# EAGLE design yaca-base (EAGLE 5.04)
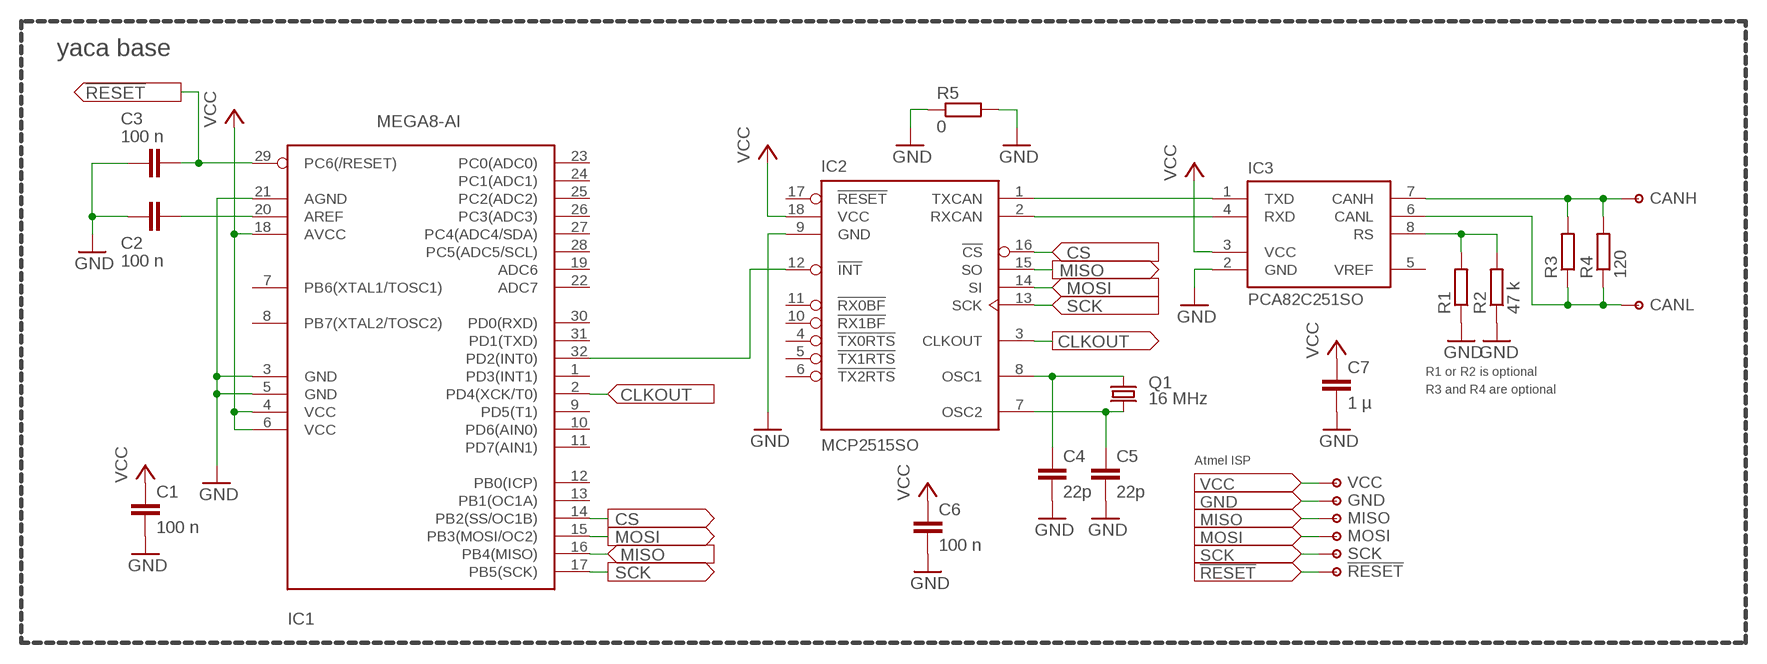
[diagram p0: schematic, sheet 1]

## Parts
C1  100 n  C-EUC0805  [C0805]
C2  100 n  C-EUC0805  [C0805]
C3  100 n  C-EUC1206  [C1206]
C4  22p  C-EUC1206  [C1206]
C5  22p  C-EUC1206  [C1206]
C6  100 n  C-EUC1206  [C1206]
C7  1 µ  C-EUC1206  [C1206]
IC1  MEGA8-AI  [TQFP32-08]
IC2  MCP2515SO  [SO18]
IC3  PCA82C251SO  [SO08]
P1  VCC  PAD  [PAD]
P2  GND  PAD  [PAD]
P3  MISO  PAD  [PAD]
P4  MOSI  PAD  [PAD]
P5  SCK  PAD  [PAD]
P6  !RESET  PAD  [PAD]
P7  CANH  PAD  [PAD]
P8  CANL  PAD  [PAD]
Q1  16 MHz  CRYSTALSM49  [SM49]
R1  47 k  R-EU_R0805  [R0805]
R2  47 k  R-EU_0204/7  [0204/7]
R3  120  R-EU_R0805  [R0805]
R4  120  R-EU_0207/10  [0207/10]
R5  0  R-EU_R1206  [R1206]

## Nets
!RESET: C3.1 IC1.29(PC6(/RESET)) P6.1(P)
CANH: IC3.7(CANH) P7.1(P) R3.2 R4.2
CANL: IC3.6(CANL) P8.1(P) R3.1 R4.1
CLKOUT: IC1.2(PD4(XCK/T0)) IC2.3(CLKOUT)
CS: IC1.14(PB2(SS/OC1B)) IC2.16(!CS)
GND: C1.2 C2.2 C3.2 C4.2 C5.2 C6.2 C7.2 IC1.3(GND) IC1.5(GND) IC1.21(AGND) IC2.9(GND) IC3.2(GND) P2.1(P) R1.1 R2.1 R5.1 R5.2
INT: IC1.32(PD2(INT0)) IC2.12(!INT)
MISO: IC1.16(PB4(MISO)) IC2.15(SO) P3.1(P)
MOSI: IC1.15(PB3(MOSI/OC2)) IC2.14(SI) P4.1(P)
N$2: C2.1 IC1.20(AREF)
RS: IC3.8(RS) R1.2 R2.2
RXCAN: IC2.2(RXCAN) IC3.4(RXD)
SCK: IC1.17(PB5(SCK)) IC2.13(SCK) P5.1(P)
TXCAN: IC2.1(TXCAN) IC3.1(TXD)
VCC: C1.1 C6.1 C7.1 IC1.4(VCC) IC1.6(VCC) IC1.18(AVCC) IC2.18(VCC) IC3.3(VCC) P1.1(P)
X1: C4.1 IC2.8(OSC1) Q1.1
X2: C5.1 IC2.7(OSC2) Q1.2
Unconnected: IC1.1(PD3(INT1)) IC1.7(PB6(XTAL1/TOSC1)) IC1.8(PB7(XTAL2/TOSC2)) IC1.9(PD5(T1)) IC1.10(PD6(AIN0)) IC1.11(PD7(AIN1)) IC1.12(PB0(ICP)) IC1.13(PB1(OC1A)) IC1.19(ADC6) IC1.22(ADC7) IC1.23(PC0(ADC0)) IC1.24(PC1(ADC1)) IC1.25(PC2(ADC2)) IC1.26(PC3(ADC3)) IC1.27(PC4(ADC4/SDA)) IC1.28(PC5(ADC5/SCL)) IC1.30(PD0(RXD)) IC1.31(PD1(TXD)) IC2.4(!TX0RTS) IC2.5(!TX1RTS) IC2.6(!TX2RTS) IC2.10(!RX1BF) IC2.11(!RX0BF) IC2.17(!RESET) IC3.5(VREF)

## Notes on the sheet
- yaca base
- R1 or R2 is optional
- R3 and R4 are optional
- Atmel ISP

## Library data of the parts
C1-C7 = rcl:C-EU: CAPACITOR, European symbol
IC1 = atmel:MEGA8: MICROCONTROLLER 8 Kbytes FLASH, 1 kbytes SRAM, 512 bytes EEPROM, USART, 6-channel 10 bit ADC, 2-channel 8 bit ADC Pin compatible with Atmega48, ATMega88, ATMega168 Source: avr.lbr
IC2 = yaca:MCP2515: MCP2515 CAN controller from Microchip
IC3 = yaca:PCA82C251: PCA82C251 or MCP2551 CAN transceivers
P1-P8 = yaca:PAD: SMD soldering pad
Q1 = crystal:CRYSTAL: CRYSTAL
R1-R5 = rcl:R-EU_: RESISTOR, European symbol

## Board
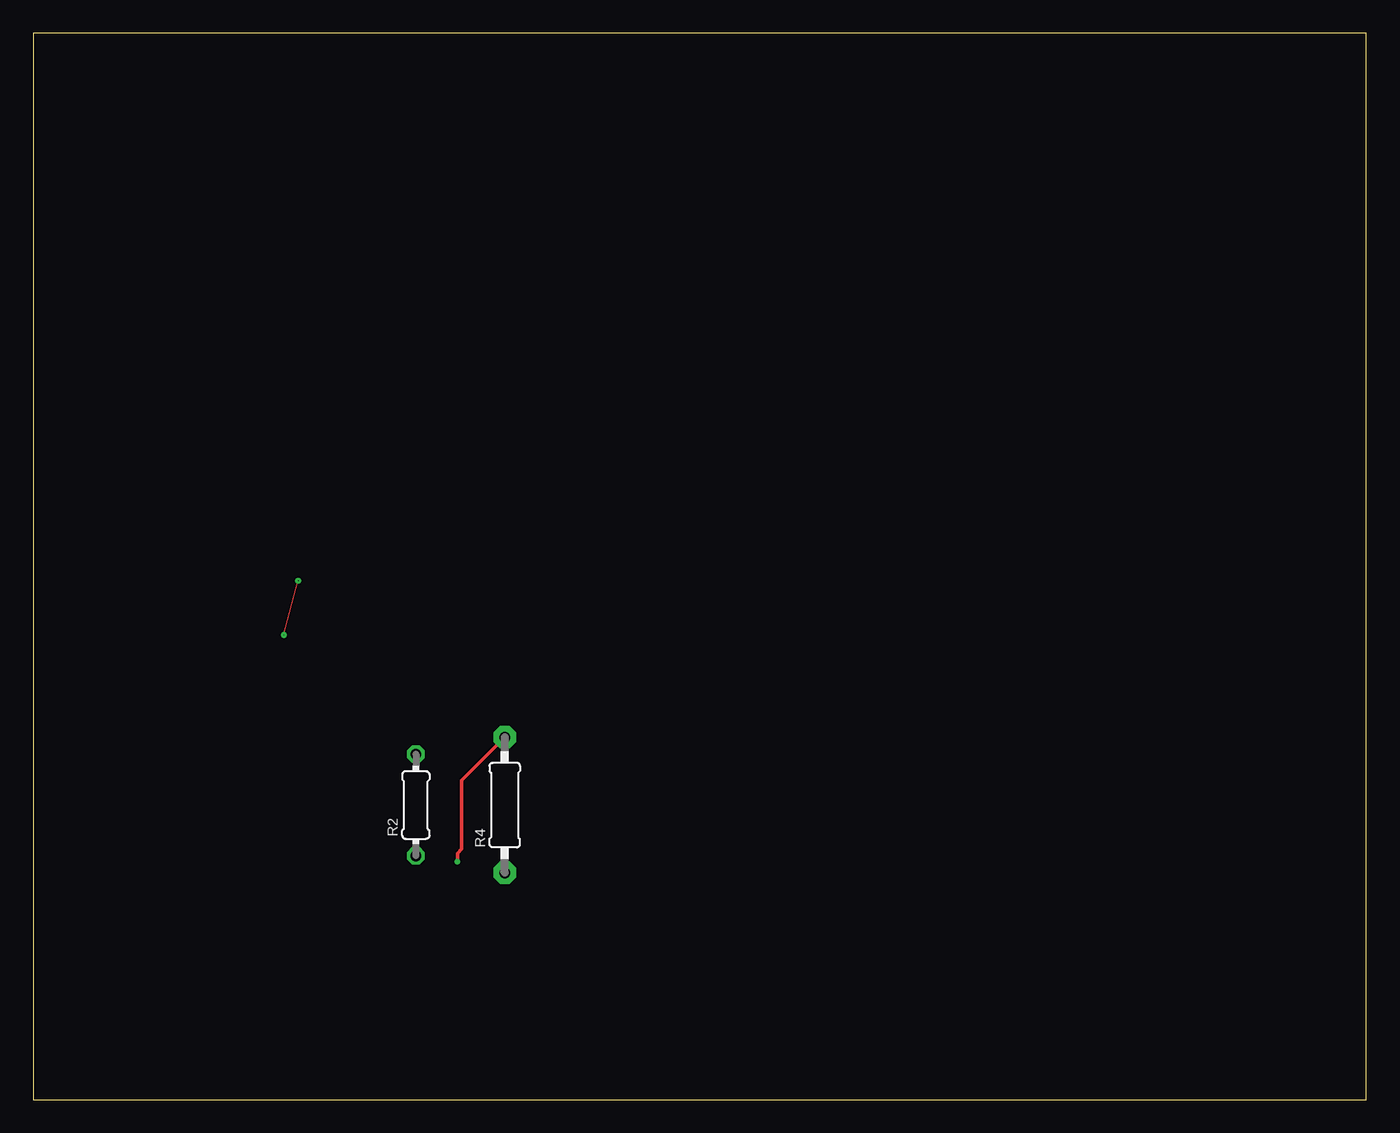
[diagram p1: board, top side]
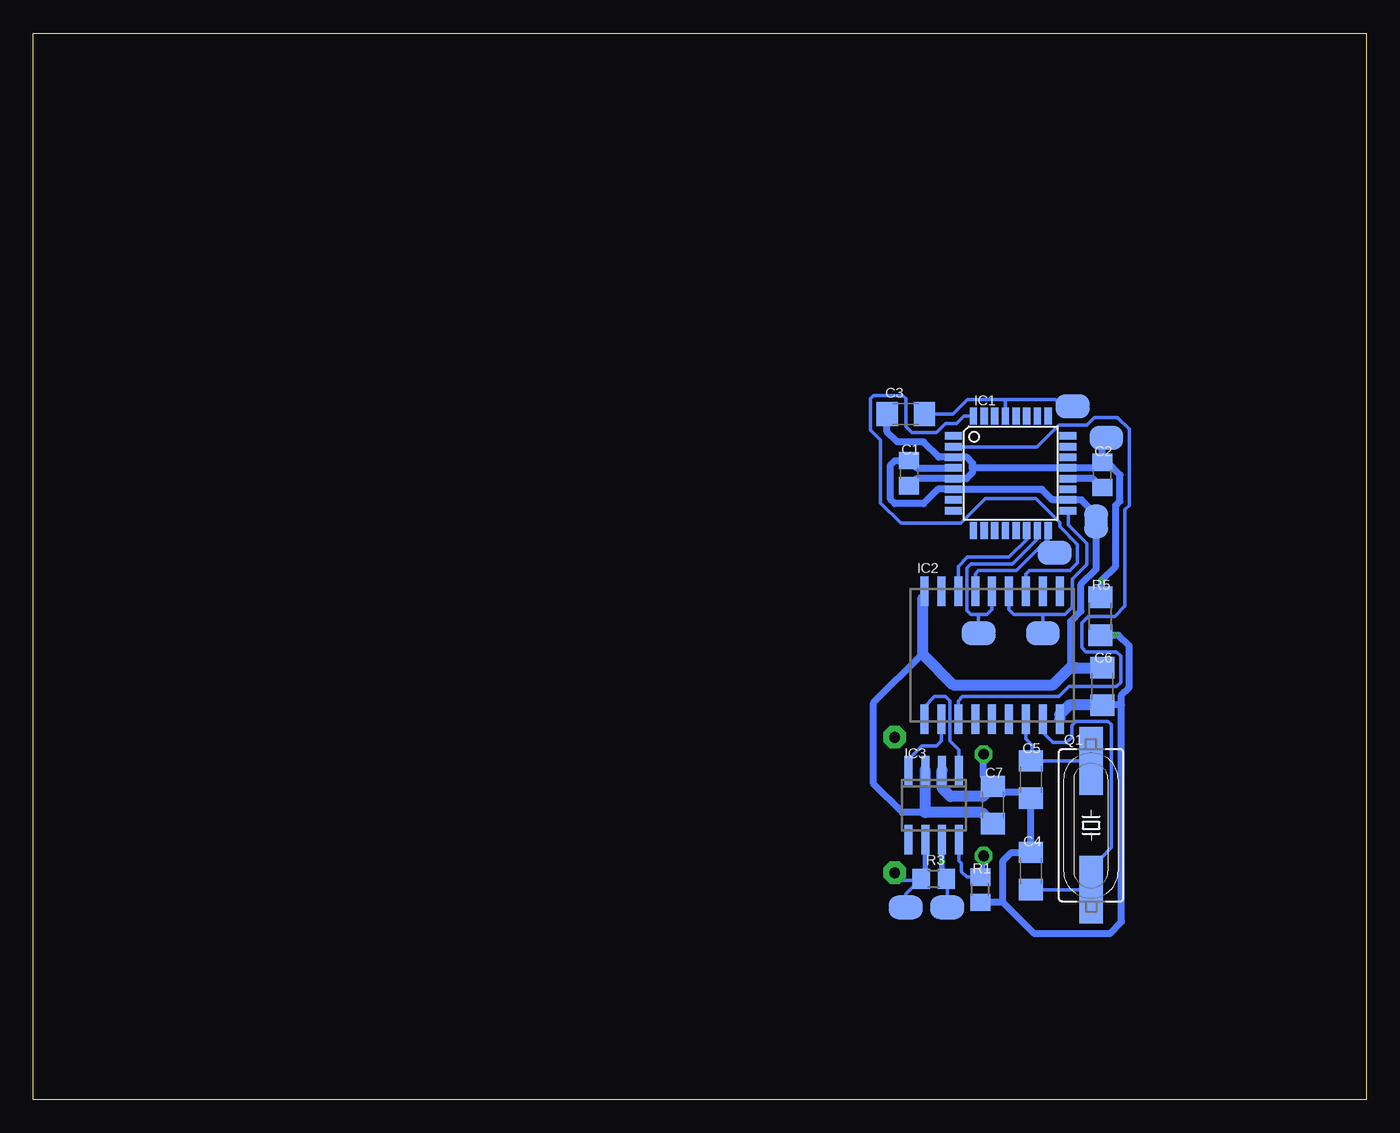
[diagram p2: board, bottom side, seen from below]

Size 100 x 80 mm. Coordinates in mm from the lower left corner, seen from the top.
Outline: 0,0 100,0 100,80 0,80 0,0
Copper layers (1*16): Top 0.035mm / dielectric 1.5mm / Bottom 0.035mm
Design rules "default": minimum track width 10mil, minimum drill 24mil, track to track 8mil, track to pad 8mil, pad to pad 8mil, via to via 8mil, smd to smd 8mil, copper to edge 40mil, drill to drill 8mil, minimum pad ring 10mil, minimum via ring 8mil, stop-mask expansion 4mil, vias tented up to drill 0mil, thermal gap 10mil

### Footprints (pad centres in the part's own frame; a part is rotated, then mirrored left to right if it is on the bottom)
C0805 = smd 1.3 x 1.5: 1 -0.95,0; 2 0.95,0
C1206 = smd 1.6 x 1.8: 1 -1.4,0; 2 1.4,0
TQFP32-08 = smd 1.27 x 0.559: 1 -4.293,2.8; 2 -4.293,2; 3 -4.293,1.2; 4 -4.293,0.4; 5 -4.293,-0.4; 6 -4.293,-1.2; 7 -4.293,-2; 8 -4.293,-2.8; 17 4.293,-2.8; 18 4.293,-2; 19 4.293,-1.2; 20 4.293,-0.4; 21 4.293,0.4; 22 4.293,1.2; 23 4.293,2; 24 4.293,2.8 | smd 0.559 x 1.27: 9 -2.8,-4.293; 10 -2,-4.293; 11 -1.2,-4.293; 12 -0.4,-4.293; 13 0.4,-4.293; 14 1.2,-4.293; 15 2,-4.293; 16 2.8,-4.293; 25 2.8,4.293; 26 2,4.293; 27 1.2,4.293; 28 0.4,4.293; 29 -0.4,4.293; 30 -1.2,4.293; 31 -2,4.293; 32 -2.8,4.293
SO18 = smd 0.6 x 2.2: 1 -5.08,-4.8; 2 -3.81,-4.8; 3 -2.54,-4.8; 4 -1.27,-4.8; 5 0,-4.8; 6 1.27,-4.8; 7 2.54,-4.8; 8 3.81,-4.8; 9 5.08,-4.8; 10 5.08,4.8; 11 3.81,4.8; 12 2.54,4.8; 13 1.27,4.8; 14 0,4.8; 15 -1.27,4.8; 16 -2.54,4.8; 17 -3.81,4.8; 18 -5.08,4.8
SO08 = smd 0.6 x 2.2: 1 -1.905,-2.6; 2 -0.635,-2.6; 3 0.635,-2.6; 4 1.905,-2.6; 5 1.905,2.6; 6 0.635,2.6; 7 -0.635,2.6; 8 -1.905,2.6
PAD = smd 2.54 x 1.778: 1 0,0
SM49 = smd 5.08 x 1.778: 1 -4.826,0; 2 4.826,0
R0805 = smd 1.3 x 1.5: 1 -0.95,0; 2 0.95,0
0204/7 = drill 0.813 octagon: 1 -3.81,0; 2 3.81,0
0207/10 = drill 0.813 pad 1.676 octagon: 1 -5.08,0; 2 5.08,0
R1206 = smd 1.6 x 1.803: 1 -1.422,0; 2 1.422,0

### Placement (x,y rotation side)
C1  34.29,46.99 270 bottom
C2  19.81,46.86 90 bottom
C3  34.54,51.44 180 bottom
C4  25.15,17.14 90 bottom
C5  25.15,24 270 bottom
C6  19.81,30.99 270 bottom
C7  28,22.1 90 bottom
IC1  26.67,46.99 0 bottom
IC2  28.07,33.34 0 bottom
IC3  32.45,22.1 180 bottom
P1  20.26,43.37 90 bottom
P2  19.49,49.66 0 bottom
P3  23.37,41.02 0 bottom
P4  29.08,34.99 180 bottom
P5  24.26,34.99 0 bottom
P6  22.03,52.01 0 bottom
P7  31.43,14.41 180 bottom
P8  34.54,14.41 0 bottom
Q1  20.64,20.57 90 bottom
R1  28.96,15.75 90 bottom
R2  28.7,22.1 270 top
R3  32.45,16.57 0 bottom
R4  35.37,22.1 90 top
R5  19.94,36.26 270 bottom

### Tracks (layer width: path | path; a pad name or v marks a point on that pad's centre or on a via)
!RESET
  Bottom 0.254: 27.05,52.51 29.91,52.51 30.99,51.44 C3.1 | IC1.29 27.07,52.49 27.05,52.51 | 27.05,52.51 23.3,52.51 22.92,52.13 22.29,52.13 P6.1
CANH  (via drill 0)
  Top 0.254: v31.81,17.84 31.81,18.48 32.13,18.8 32.13,23.94 R4.2
  Bottom 0.254: 31.81,16.89 R3.2 31.43,16.51 P7.1 | IC3.7 31.81,20.26
  Bottom 0.406: 31.81,16.89 v31.81,17.84 IC3.7
CANL
  Bottom 0.254: R3.1 33.08,16.89 | R3.1 33.72,16.45 34.8,16.45 R4.1 | P8.1 34.54,15.43 R3.1
  Bottom 0.406: 33.08,16.89 IC3.6
CLKOUT
  Bottom 0.254: IC2.3 30.61,29.91 30.29,30.23 23.05,30.23 22.29,30.99 18.73,30.99 18.41,31.3 18.41,33.27 18.73,33.59 21.02,33.59 21.34,33.91 21.34,35.75 20.83,36.26 18.86,36.26 18.1,37.02 18.1,44.26 17.78,44.58 17.78,50.29 18.67,51.18 20.38,51.18 20.95,50.61 23.05,50.61 24.7,48.96 30.93,48.96 IC1.2
CS
  Bottom 0.254: IC1.14 25.47,42.03 26.8,40.7 29.91,40.7 30.61,40.01 IC2.16
GND  (via drill 0.03)
  Top 0.051: v18.8,34.86 v19.88,38.92
  Bottom 0.254: 27.69,23.05 C7.2 | 18.68,34.84 18.68,34.92 v18.8,34.86
  Bottom 0.508: C1.2 33.74,46.59 IC1.5 29.99,46.59 29.53,47.05 29.53,47.31 | 29.53,47.31 29.53,47.75 29.96,48.19 IC1.3 32.07,48.2 33.21,49.34 35.18,49.34 35.94,50.1 C3.2 | 29.53,47.31 29.45,47.39 IC1.21 20.23,47.39 C2.2 | C6.2 19.36,29.91 C6.2 18.35,29.59 | C2.2 19.43,47.81 18.48,46.86 18.48,44.9 18.8,44.58 18.8,40.01 v19.88,38.92 19.88,38 R5.1 | 27.24,14.8 24.89,12.45 19.24,12.45 18.35,13.34 18.35,29.59 | 27.24,14.8 27.24,17.91 26.61,18.54 C4.2 C5.2 25.15,23.11 25.15,23.05 27.69,23.05 | R2.1 28.7,24.2 C7.2 | R1.1 27.24,14.8 | C2.2 19.81,49.66 P2.1 | 18.35,29.59 18.35,30.35 17.78,30.92 17.78,34.04 18.58,34.84 18.68,34.84 R5.2
  Bottom 0.813: C6.2 22.29,29.59 22.99,28.89 IC2.9 | IC3.2 31.81,23.37 31.18,22.73 28.77,22.73 C7.2
INT
  Bottom 0.254: IC1.32 30.19,51.28 30.73,50.74 31.56,50.74 32.26,50.04 34.1,50.04 34.54,50.48 34.54,52.58 34.8,52.83 36.96,52.83 37.21,52.58 37.21,50.23 36.45,49.47 36.45,44.77 34.92,43.24 30.42,43.24 28.57,45.09 24.77,45.09 22.99,43.31 22.99,42.99 21.65,41.66 21.65,40.26 22.23,39.69 25.27,39.69 25.53,39.43 IC2.12
MISO
  Bottom 0.254: 23.87,42.04 IC1.16 | 23.87,42.04 26.23,39.69 29.08,39.69 29.34,39.43 IC2.15 | P3.1 23.86,41.47 23.87,42.04
MOSI
  Bottom 0.254: IC1.15 24.67,42.07 26.54,40.2 29.65,40.2 29.97,39.88 29.97,36.7 29.65,36.39 29.08,36.39 | IC2.14 28.07,36.77 28.45,36.39 29.08,36.39 | P4.1 29.08,36.39
N$2
  Bottom 0.508: IC1.20 20.49,46.59 C2.1
RS
  Bottom 0.254: IC3.8 30.54,18.29 30.54,17.9 30.35,17.72 30.35,17.08 29.97,16.7 R1.2 28.7,16.95 R2.2
RXCAN
  Bottom 0.254: IC2.2 31.88,26.92 32.26,26.54 33.34,26.54 34.35,25.53 IC3.4
SCK
  Bottom 0.254: IC1.17 22.35,44.13 22.35,43.11 20.95,41.72 20.95,40.13 22.04,39.05 22.04,36.96 22.61,36.39 24.26,36.39 | P5.1 24.26,36.39 | 24.26,36.39 26.42,36.39 26.8,36.77 IC2.13
TXCAN
  Bottom 0.254: IC2.1 33.15,29.46 32.38,30.23 31.56,30.23 31.24,29.91 31.24,26.92 30.54,26.23 IC3.1
VCC
  Bottom 0.254: 33.27,37.59 IC2.18 | P1.1 20.03,43.59 20.03,43.66
  Bottom 0.508: 30.94,47.37 IC1.4 33.74,47.39 C1.1 34.67,47.94 35.37,47.94 35.69,47.62 35.69,45.02 35.37,44.7 33.21,44.7 32.12,45.79 IC1.6 24.32,45.78 23.53,44.99 IC1.18 21.37,44.99 20.03,43.66 20.26,43.12 20.26,39.81 21.4,38.67 21.4,36.64 22.16,35.88 22.16,32.77 21.78,32.38 C6.1 | 33.08,21.53 34.8,21.53 36.96,23.69 36.96,29.78 33.27,33.47
  Bottom 0.813: C6.1 19.88,32.38 21.72,32.38 21.71,32.38 22.23,32.38 23.5,31.11 30.99,31.11 33.27,33.4 33.27,33.47 33.27,37.59 | IC3.3 33.08,21.53 28.83,21.53 C7.1
X1
  Bottom 0.254: IC2.8 24.26,27.56 23.5,26.8 22.48,26.8 22.1,27.18 22.1,28.07 21.78,28.38 19.37,28.38 19.11,28.13 19.11,18.92 20.64,17.34 Q1.1 C4.1
X2
  Bottom 0.254: IC2.7 25.53,27.05 25.08,26.61 25.08,25.27 25.53,26.04 25.15,25.65 C5.1 Q1.2